# Altium schematic sheet 5V0_VoltageReg.SchDoc
size 420 x 297 mm; SheetNumber: 7; SheetTotal: 21
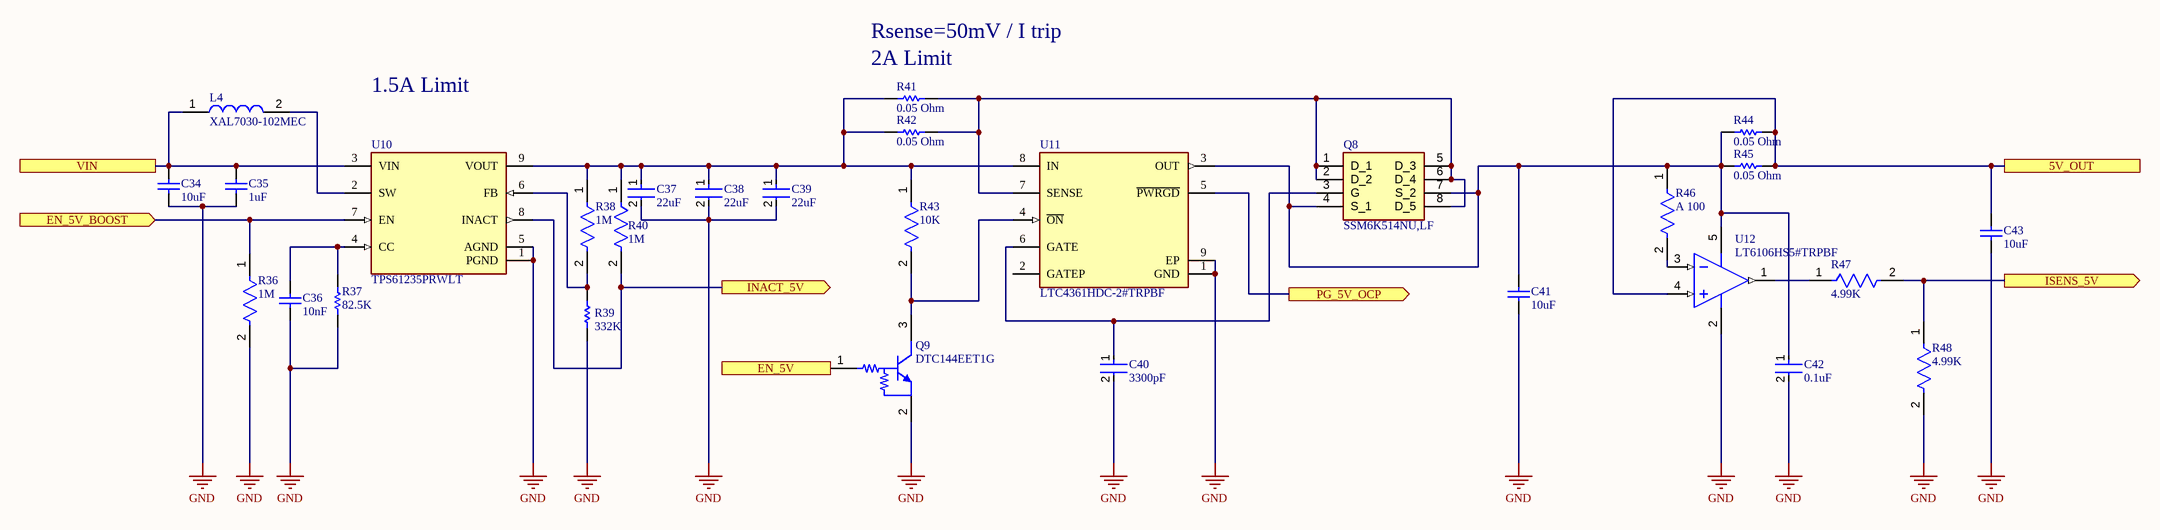
[diagram p0: 5V0_VoltageReg.SchDoc]

## Parts
C34  10uF  [CAPC2013X140X45NL15T25]
C35  1uF  [CAPC1608X90X35ML10T15]
C36  10nF  [CAPC1608X90X35LL10T15]
C37  22uF  [FP-GRM21B-0_2-e0_2_0_7-IPC_C]
C38  22uF  [FP-GRM21B-0_2-e0_2_0_7-IPC_C]
C39  22uF  [FP-GRM21B-0_2-e0_2_0_7-IPC_C]
C40  3300pF  [FP-C0603C-CF-MFG]
C41  10uF  [CAPC2013X140X45NL15T25]
C42  0.1uF  [FP-C0603C-CF-MFG]
C43  10uF  [CAPC2013X140X45NL15T25]
L4  XAL7030-102MEC  [XAL7030102MEC]
Q8  SSM6K514NU,LF  [UDFN6B]
Q9  DTC144EET1G  [ONSC-SC-75-3-463-01_V]
R36  1M  [FP-ERJ3EK-IPC_C]
R37  82.5K  [RESC1608X55X30NL20T10]
R38  1M  [FP-ERJ3EK-IPC_C]
R39  332K  [RESC1608X55X30ML15T15]
R40  1M  [FP-ERJ3EK-IPC_C]
R41  0.05 Ohm  [RESC1608X55X30NL15T15]
R42  0.05 Ohm  [RESC1608X55X30NL15T15]
R43  10K  [FP-RK73B1J-MFG]
R44  0.05 Ohm  [RESC1608X55X30NL15T15]
R45  0.05 Ohm  [RESC1608X55X30NL15T15]
R46  A 100  [FP-ERA3A-IPC_B]
R47  4.99K  [FP-ERA3A-IPC_C]
R48  4.99K  [FP-ERA3A-IPC_C]
U10  TPS61235PRWLT  [FP-RWL0009A-MFG]
U11  LTC4361HDC-2#TRPBF  [FP-DC8-8-05-08-1719-IPC_C]
U12  LT6106HS5#TRPBF  [LT-S5-5-TSOT-23_M]

## Ports
5V_OUT, EN_5V (in), EN_5V_BOOST (in), INACT_5V (out), ISENS_5V (out), PG_5V_OCP (out), VIN

## Nets
GND: C34.1 C35.1 C36.1 C37.2 C38.2 C39.2 C40.2 C41.1 C42.2 C43.1 Q9.2(E) R36.2 R37.1 R39.1 R48.2 U10.1(PGND) U10.5(AGND) U11.1(GND) U11.9(EP) U12.2(V-)
5V_OUT: C43.2 R44.2 R45.2 U12.4(+IN) ; port 5V_OUT
EN_5V: Q9.1(B) ; port EN_5V
EN_5V_BOOST: R36.1 U10.7(EN) ; port EN_5V_BOOST
INACT_5V: R40.2 U10.8(INACT) ; port INACT_5V
ISENS_5V: R47.2 R48.1 ; port ISENS_5V
PG_5V_OCP: U11.5(~{PWRGD}) ; port PG_5V_OCP
VIN: C34.2 C35.2 L4.1 U10.3(VIN) ; port VIN
NetC36_2: C36.2 R37.2 U10.4(CC)
NetC37_1: C37.1 C38.1 C39.1 R38.1 R40.1 R41.1 R42.1 R43.1 U10.9(VOUT) U11.8(IN)
NetC40_1: C40.1 Q8.3(G) U11.6(GATE)
NetC41_2: C41.2 C42.1 Q8.4(S_1) Q8.7(S_2) R44.1 R45.1 R46.1 U11.3(OUT) U12.5(V+)
NetL4_2: L4.2 U10.2(SW)
NetQ8_1: Q8.1(D_1) Q8.2(D_2) Q8.5(D_3) Q8.6(D_4) Q8.8(D_5) R41.2 R42.2 U11.7(SENSE)
NetQ9_3: Q9.3(C) R43.2 U11.4(~{ON})
NetR38_2: R38.2 R39.2 U10.6(FB)
NetR46_2: R46.2 U12.3(-IN)
NetR47_1: R47.1 U12.1(OUT)

Not connected (* = marked no-connect by the designer): U11 2(GATEP)

## Notes on the sheet
- Rsense=50mV / I trip
- 1.5A Limit
- (near R41) 2A Limit
- THIS DOCUMENT AND THE DATA DISCLOSED HEREIN OR
- HEREWITH IS THE PROPERTY OF ALTIUM LIMITED AND MAY
- DWG NO:
- REVISION
- REV:
- DESCRIPTION
- DATE
- APPROVED
- BE FREELY DISTRIBUTED IN WHOLE. NO RIGHTS ARE
- RESERVED OR EXPRESS OR IMPLIED WARANTEE GIVEN.
- ENG:
- APPROVALS
- PROJECT
- DSN:
- CHK:
- REFERENCE DOCUMENTS
- PROJECT REVISION:
- TITLE
- DOCUMENT REVISION:
- DESIGN ITEM:
- BOM:
- FAB DWG:
- PCB DWG:
- ASSY DWG:
- SCALE:
- A3
- SIZE
- CAGE CODE
- FILE NAME
- DWG NO.
- SHEET
- OF
- REV

## Library data of the parts
C34 C41 C43 = CMP-2007-03395-1: Part Number: GRM21BR71A106KE51L; Manufacturer: Murata
C35 = CMP-2006-02534-1: Part Number: GRM188R71C105KA12J; Manufacturer: Murata
C36 = CMP-2000-06338-1: Chip Capacitor, 10000 pF, +/- 10%, 16 V, -55 to 125 degC, 0603 (1608 Metric), RoHS, Tape and Reel; Manufacturer: Murata; Rated Voltage: 16V; Dielectric: X7R; Mounting Technology: SurfaceMount; Tolerance (%): ±10%; Case Size/Dimension: 0603; Datasheet URL: http://search.murata.co.jp/Ceramy/image/img/A01X/G101/ENG/GRM188R71C103KA01-01.pdf; Datasheet Version: 02/2016; Manufacturer URL: http://www.murata.com/; Package Reference: 0603; Package Description: 2-Pin Surface Mount Device, Body 1.6 x 0.8 mm; Capacitance: 10nF
C37-C39 = CMP-06035-025845-1: Chip Multilayer Ceramic Capacitors for General Purpose, 0805, 22uF, X7T, +22%/-33%, 20%, 10V; Dissipation Factor: 0.035%; Height: 1.25mm; Min Operating Temperature: -55°C; Case/Package: 0805; Packaging: Tape and Reel; Voltage: 10V; Depth: 1.25mm; Width: 1.25mm; Voltage Rating: 10V; Dielectric: X7T; Weight: 0.000335oz; Capacitance: 22uF; Mount: Surface Mount; Package Quantity: 3000; Lead Free: Lead Free; Tolerance: 20%; Thickness: 0.057inch; Max Operating Temperature: 125°C; Length: 2mm; Material: Ceramic; Case Code (Metric): 2012; Termination: SMD/SMT; Voltage Rating (DC): 10V; Dielectric Material: Ceramic; Case Code (Imperial): 0805
C40 = CMP-2006-03174-2: CAP CER 3300PF 50V 5% X7R 0603; Manufacturer Part Number: C0603C332J5RACTU; Manufacturer: KEMET; Automotive Grade: Grade 1; Material: Ceramic; Value: 3,300 pF; Temperature Coefficient: 30ppm/°C; Tolerance: 0.05; Temperature Range Low: -55°C; Device Class L3: Ceramic Capacitors; Temperature Characteristic: X7R; Temperature: -55°C to +125°C; Device Class L1: Passive Components; ComponentLink2URL: https://api.kemet.com/component-edge/download/datasheet/C0603C100J5GACAUTO.pdf; Automotive: Yes; Capacitance: 3,300 pF; RoHS: TRUE; Mouser Description: Multilayer Ceramic Capacitors MLCC - SMD/SMT 50volts 3300pF X7R 5%; Height: 0.87mm; Temperature Range High: +125°C; ComponentLink2Description: Datasheet; Voltage Rating: 50 V; Octopart: https://octopart.com/c0603c332j5ractu-kemet-9139905; Package: C0603C-CF; Lead Free: Yes; Device Class L2: Capacitors; Digikey Description: CAP CER 3300PF 50V 5% X7R 0603; Category: Cap
C42 = CMP-2006-03061-2: CAP CER 0.1UF 50V X7R 0603; Manufacturer: KEMET; Manufacturer Part Number: C0603C104K5RACTU; Tolerance: 0.1; Temperature Coefficient: 30ppm/°C; Material: Ceramic; Automotive Grade: Grade 1; Value: 0.10 μF; Temperature: -55°C to +125°C; RoHS: TRUE; Temperature Range High: +125°C; Lead Free: Yes; Octopart: https://octopart.com/c0603c104k5ractu-kemet-139244; Digikey Description: CAP CER 0.1UF 50V X7R 0603; Category: Cap; Package: C0603C-CF; ComponentLink2Description: Datasheet; Temperature Range Low: -55°C; Device Class L1: Passive Components; Voltage Rating: 50 V; Automotive: Yes; Device Class L3: Ceramic Capacitors; ComponentLink2URL: https://api.kemet.com/component-edge/download/datasheet/C0603C100J5GACAUTO.pdf; Capacitance: 0.10 μF; Device Class L2: Capacitors; Temperature Characteristic: X7R; Height: 0.87mm
L4 = CMP-006-00034-2: Fixed Inductors 1uH Shld 20% 21.8A 5mOhms AECQ2; Manufacturer_Name: COILCRAFT; Mouser Part Number: 994-XAL7030-102MEC; Height: 3.1mm; Source: SamacSys.SchLib; Mouser Price/Stock: https://www.mouser.co.uk/ProductDetail/Coilcraft/XAL7030-102MEC?qs=zCSbvcPd3pYbk2HvDIgkpA%3D%3D; Design Item ID: XAL7030-102MEC; Manufacturer_Part_Number: XAL7030-102MEC; Datasheet Link: https://www.coilcraft.com/pdfs/xal7030.pdf
Q8 = SSM6K514NU,LF: MOSFET (N-Channel); Manufacturer_Name: Toshiba; Datasheet Link: http://toshiba.semicon-storage.com/info/docget.jsp?did=29875&prodName=SSM6N7002CFU; Manufacturer_Part_Number: SSM6K514NU,LF; Mouser Part Number: 757-SSM6K514NULF; Mouser Price/Stock: https://www.mouser.co.uk/ProductDetail/Toshiba/SSM6K514NULF?qs=yfGysFjEcj13lHFOvblArQ%3D%3D; Arrow Part Number: SSM6K514NU,LF; Arrow Price/Stock: https://www.arrow.com/en/products/ssm6k514nulf/toshiba?region=nac
Q9 = CMP-0630-00198-1: Digital Transistor (BRT), R1=47 kOhm, R2=47 kOhm, NPN Transistor, 3-Pin SC-75, Pb-Free, Tape and Reel; Manufacturer: On Semiconductor; hFE Min: 80; R1/R2 Typ: 1; IC Continuous (A): 0.1; V(BR)CEO Min (V): 50; Mounting Technology: Surface Mount; PartNumber: DTC144EET1G; Polarity: NPN; PackageReference: SC-75-3-463-01; ComponentLink2URL: http://www.onsemi.cn/pub_link/Collateral/DTC144E-D.PDF; PackageVersion: Rev. F, 07/2005; ComponentLink3Description: Package Specification; ComponentLink1Description: Manufacturer URL; ComponentLink1URL: http://www.onsemi.com/; DatasheetVersion: Rev. 2; Packing: Tape and Reel; PackageDescription: 3-Pin Small Outline Transistor, Body 1.6 x 0.8 mm, Pitch 0.5 mm; ComponentLink2Description: Datasheet; RoHS: TRUE; ComponentLink3URL: http://www.onsemi.com/pub_link/Collateral/463-01.PDF
R36 R38 R40 = CMP-1012-00849-3: RES SMD 1M OHM 1% 1/10W 0603; Resistance: 1MR; Voltage Rating: 75V; Temperature Coefficient: 100ppm/°C; Power Rating: 100mW; REACH SVHC: No SVHC; Radiation Hardening: No; Features: Automotive AEC-Q200; Case Code (Metric): 1608; Resistance Tolerance: 1%; Case/Package: 0603; Termination: SMD/SMT; Max Operating Temperature: 155°C; Tolerance: 1%; Size Code: 0603; Case Code (Imperial): 0603; Min Operating Temperature: -55°C; Number of Pins: 2; Mount: Surface Mount; Package Quantity: 1; Military Standard: Not; Voltage Rating (DC): 75V; Depth: 0.8mm; Packaging: Tape and Reel; Width: 0.8mm; Number of Terminations: 2; Length: 1.6mm; Height: 0.022inch; RoHS Compliant: Yes; Resistor Type: Thick Film; Contact Plating: Tin; Lead Free: Lead Free; Series: ERJ; Construction: Rectangular; Max Power Dissipation: 100mW
R37 = CMP-2000-01698-1: Manufacturer: KOA Speer; Part Number: RK73H1JTTD8252F
R39 = CMP-2000-00442-1: Manufacturer: Panasonic; Part Number: ERJ-3EKF3323V
R41 R42 R44 R45 = CMP-2000-00867-1: Manufacturer: Panasonic; Part Number: ERJ-L03KF50MV
R43 = CMP-2000-01851-2: RES 10K OHM 5% 1/10W 0603; Temperature Coefficient: 200ppm/°C; Voltage Rating: 50V; Power Rating: 100mW; Resistance: 10kR; Length: 1.6mm; Lead Free: Lead Free; Resistance Tolerance: 5%; Case Code (Metric): 1608; Width: 0.8mm; Height: 0.45mm; Max Operating Temperature: 155°C; RoHS Compliant: Yes; Resistor Type: Thick Film; Min Operating Temperature: -55°C; Case Code (Imperial): 0603; Technology: THICK FILM; Package Quantity: 5000; Tolerance: 5%; Case/Package: 0603; Voltage Rating (DC): 50V; Depth: 0.8mm; Packaging: Tape and Reel; Number of Pins: 2; Construction: Rectangular; Series: RK73B; Military Standard: Not; Termination: SMD/SMT
R46 = CMP-2000-00870-2: RES SMD 100 OHM 0.1% 1/10W 0603; Voltage Rating: 75V; Power Rating: 100mW; Resistance: 100R; Temperature Coefficient: 25ppm/°C; Number of Terminations: 2; Case/Package: 0603; Termination: SMD/SMT; Number of Pins: 2; Size Code: 0603; Length: 1.6mm; Min Operating Temperature: -55°C; Resistor Type: Thin Film; Depth: 0.8mm; Military Standard: Not; Packaging: Tape and Reel; RoHS Compliant: Yes; Construction: Rectangular; Resistance Tolerance: 0.1%; Contact Plating: Tin; Width: 0.8mm; Mount: Surface Mount; Case Code (Metric): 1608; Max Operating Temperature: 155°C; Height: 0.45mm; Case Code (Imperial): 0603; Series: ERA-3A; Package Quantity: 5000; REACH SVHC: No SVHC; Tolerance: 0.1%; Max Power Dissipation: 100mW; Radiation Hardening: No; Technology: METAL FILM
R47 R48 = CMP-2000-00077-5: RES SMD 4.99KOHM 0.1% 1/10W 0603; Voltage Rating (DC): 75V; Max Power Dissipation: 100mW; Temperature Coefficient: 25ppm/°C; Resistance: 4.99kR; Voltage Rating: 150V; Features: Automotive AEC-Q200; Depth: 0.8mm; Case Code (Imperial): 0603; Resistance Tolerance: 0.1%; Mount: Surface Mount; Contact Plating: Tin; Length: 1.6mm; RoHS Compliant: Yes; Termination: SMD/SMT; Width: 0.8mm; Case/Package: 0603; Series: ERA; Radiation Hardening: No; Tolerance: 0.1%; Lead Free: Lead Free; Technology: METAL FILM; Construction: Rectangular; Number of Terminations: 2; Weight: 7.1E-05oz; Power Rating: 100mW; Number of Pins: 2; Min Operating Temperature: -55°C; Height: 0.45mm; Case Code (Metric): 1608; Package Quantity: 5000; Military Standard: Not; Max Operating Temperature: 155°C; Resistor Type: Thin Film; Reach SVHC Compliant: Yes; Packaging: Tape and Reel
U10 = CMP-04918-000693-1: IC REG BOOST 5.1V 6.5A 9VQFN; Min Input Voltage: 2.3V; Max Input Voltage: 4.5V; Output Type: Fixed; Output Configuration: Positive; Synchronous Rectifier: Yes; Switching Frequency: 1MHz; Quiescent Current: 10uA; Number of Outputs: 1; Max Operating Temperature: 85°C; RoHS Compliant: Yes; Packaging: Cut Tape; Topology: Boost; Case/Package: VQFN; Lead Free: Lead Free; Min Output Voltage: 5.1V; Number of Pins: 9; Mount: Surface Mount; Output Current: 6.5A; Min Operating Temperature: -40°C
U11 = CMP-0474-00015-2: IC OVP/OCP PROTECTION CTLR 8DFN; Number of Circuits: 1; RoHS Compliant: Yes; Packaging: Tape and Reel; Case/Package: DFN; Number of Pins: 8; Package Quantity: 2500
U12 = CMP-0359-01984-2: Single Channel, Low Cost, High Side Current Sense Operational Amplifier, 0.2 MHz Typical GBW, 5-Pin SOT-23 (S5-5), High Temperature / Automotive, Pb-Free, Reel; Manufacturer: Linear Technology; Linear Technology Part Number: LT6106; Vos (mV) Typical: 0.15; Vs Min (V): 2.7; Vs Max (V): 36; Is (mA) Typical: 0.06; Vos (mV) Guaranteed: 0.25; Channels (#): 1; GBW (MHz) Typical: 0.2; PackageDescription: 5-Lead Plastic TSOT-23, Body 1.63 x 2.90 mm, Pitch 0.95 mm; ComponentLink3Description: Package Specification; Mounting Technology: Surface Mount; Type: CSA; RevisionNote: URLs updated; ComponentLink2URL: http://cds.linear.com/docs/en/datasheet/6106fa.pdf; ComponentLink1URL: http://www.linear.com/; Code_JEDEC: MO-193; PartNumber: LT6106HS5#TRPBF; Packing: Reel; DatasheetVersion: Rev. A; RoHS: Pb-Free; ComponentLink3URL: http://cds.linear.com/docs/en/packaging/SOT_5_05-08-1635.pdf; ComponentLink1Description: Manufacturer URL; PackageReference: LT-S5-5-TSOT-23; ComponentLink2Description: Datasheet